# EAGLE design CircuitoPedaleiraTcc2 (EAGLE 7.6.0)
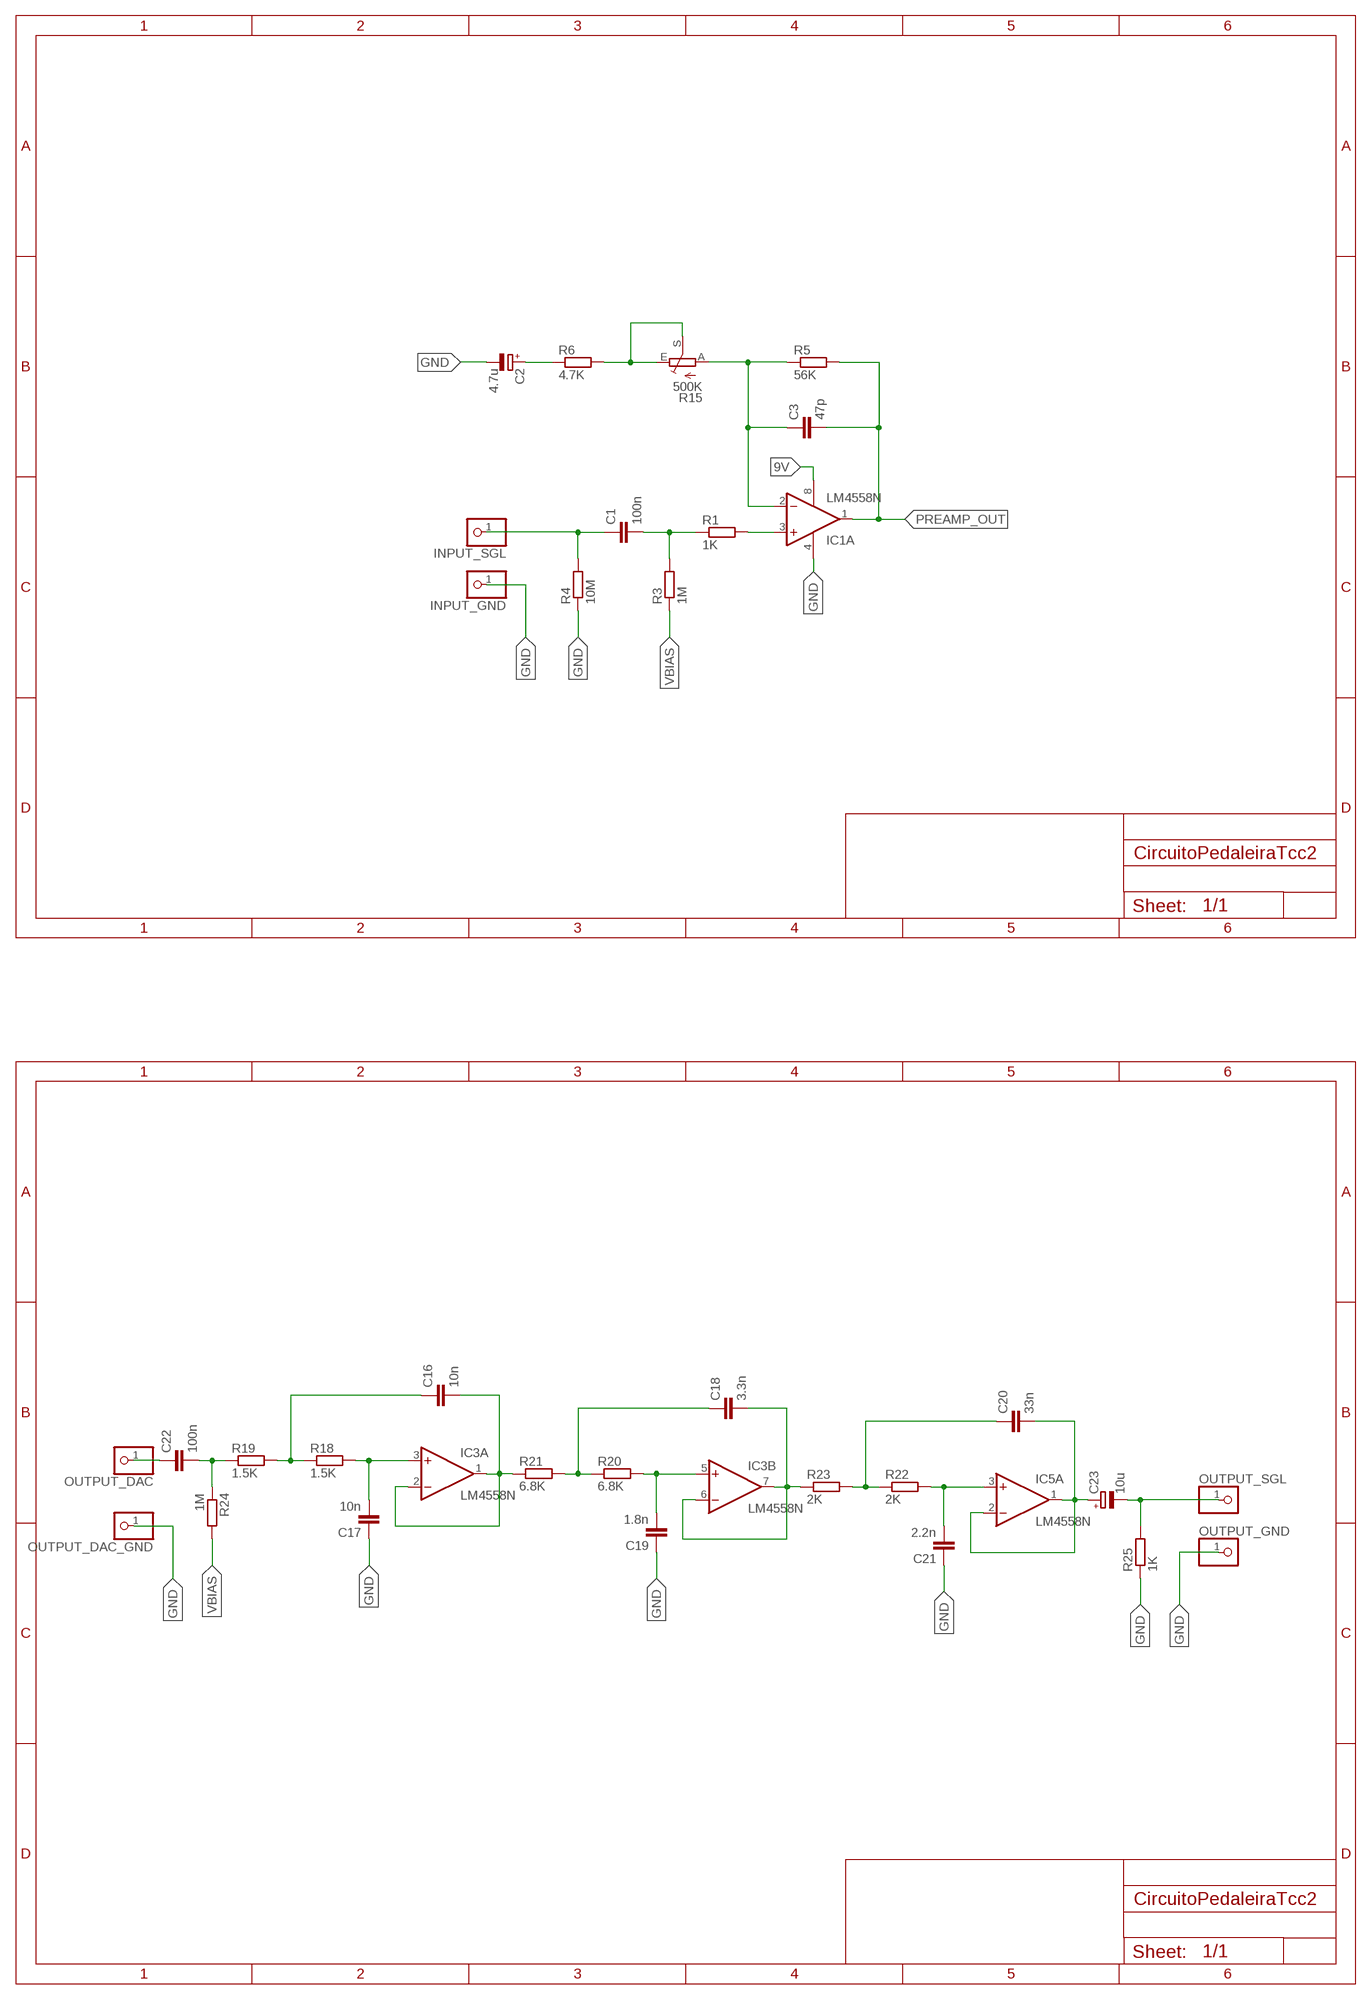
[diagram p0: schematic, sheet 1, part 1 of 3]
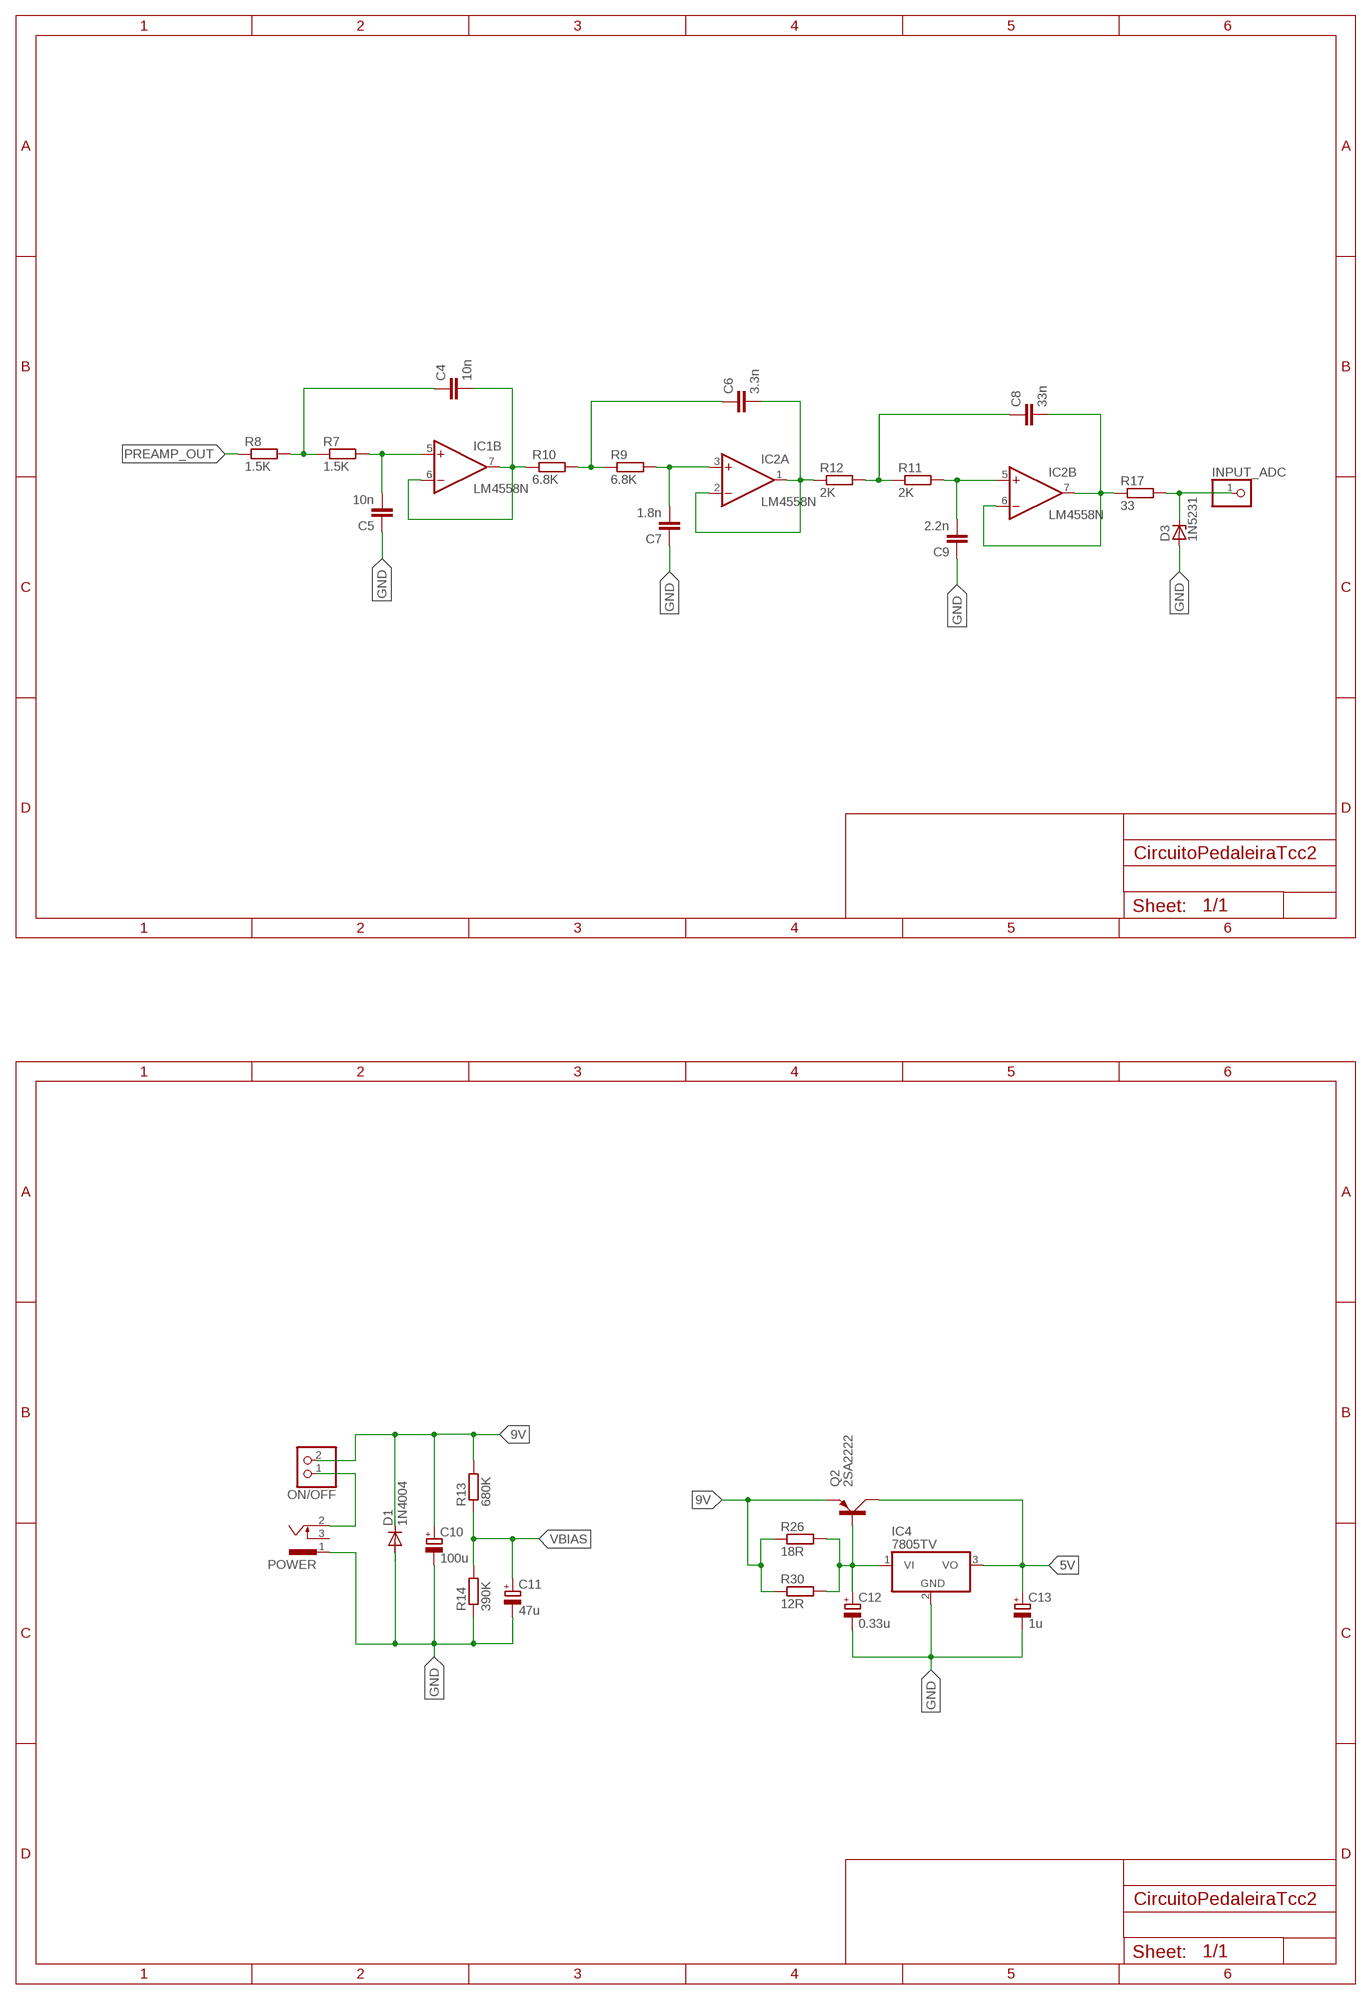
[diagram p1: schematic, sheet 1, part 2 of 3]
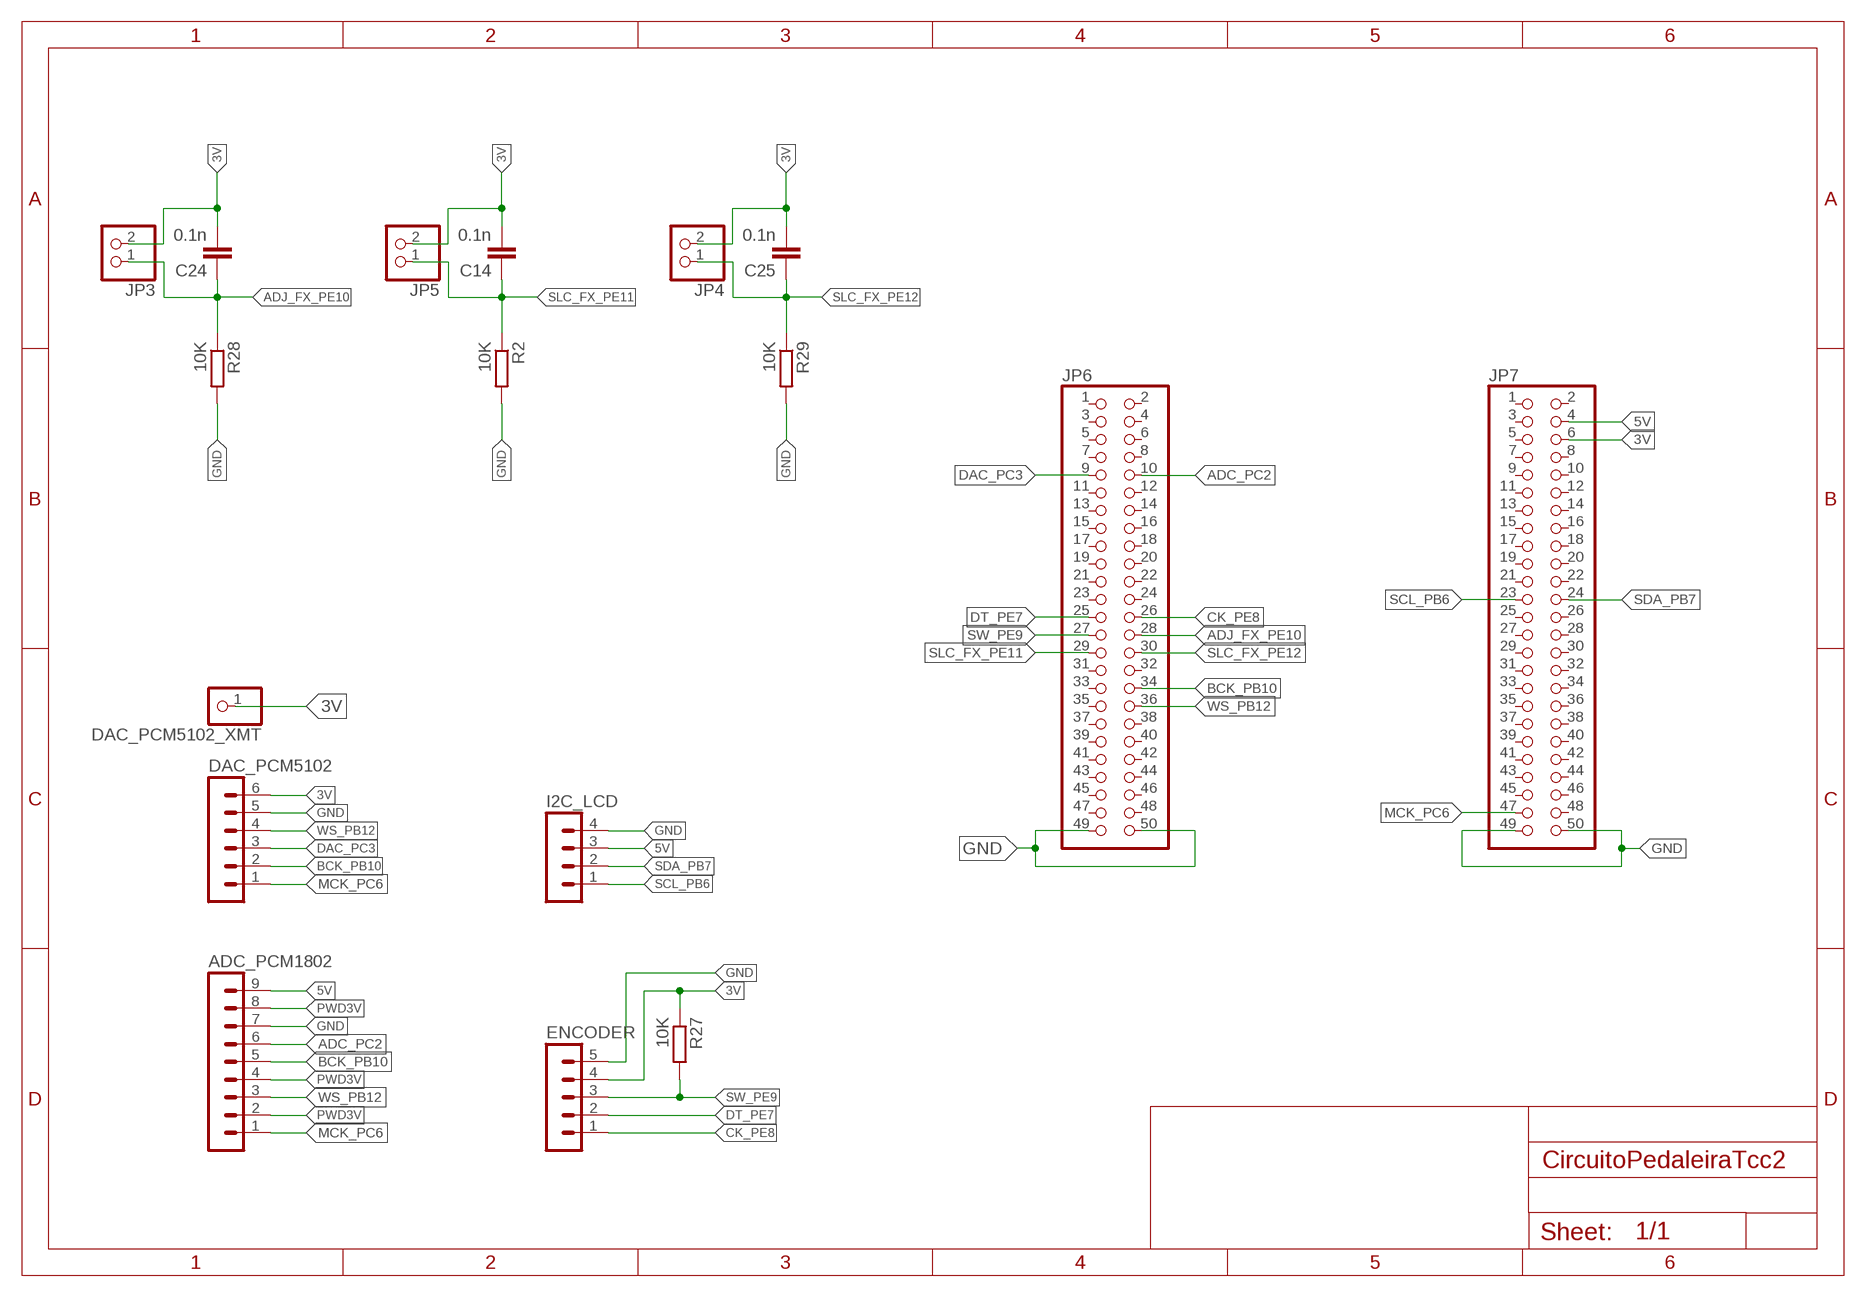
[diagram p2: schematic, sheet 1, part 3 of 3]

## Parts
ADC_PCM1802  MA09-1  [MA09-1]
C1  100n  C-EU025-025X050  [C025-025X050]
C2  4.7u  CPOL-EUE2.5-6  [E2,5-6]
C3  47p  C-EU025-025X050  [C025-025X050]
C4  10n  C-EU025-025X050  [C025-025X050]
C5  10n  C-EU025-025X050  [C025-025X050]
C6  3.3n  C-EU025-025X050  [C025-025X050]
C7  1.8n  C-EU025-025X050  [C025-025X050]
C8  33n  C-EU025-025X050  [C025-025X050]
C9  2.2n  C-EU025-025X050  [C025-025X050]
C10  100u  CPOL-EUE2.5-6  [E2,5-6]
C11  47u  CPOL-EUE2.5-6  [E2,5-6]
C12  0.33u  CPOL-EUE2.5-6  [E2,5-6]
C13  1u  CPOL-EUE2.5-6  [E2,5-6]
C14  0.1n  C-EU025-025X050  [C025-025X050]
C16  10n  C-EU025-025X050  [C025-025X050]
C17  10n  C-EU025-025X050  [C025-025X050]
C18  3.3n  C-EU025-025X050  [C025-025X050]
C19  1.8n  C-EU025-025X050  [C025-025X050]
C20  33n  C-EU025-025X050  [C025-025X050]
C21  2.2n  C-EU025-025X050  [C025-025X050]
C22  100n  C-EU025-025X050  [C025-025X050]
C23  10u  CPOL-EUE2.5-6  [E2,5-6]
C24  0.1n  C-EU025-025X050  [C025-025X050]
C25  0.1n  C-EU025-025X050  [C025-025X050]
D1  1N4004  [DO41-10]
D3  1N5231  ZENER-DIODEDO35Z10  [DO35Z10]
DAC_PCM5102  MA06-1  [MA06-1]
DAC_PCM5102_XMT  PINHD-1X1  [1X01]
ENCODER  MA05-1  [MA05-1]
I2C_LCD  MA04-1  [MA04-1]
IC1  LM4558N  [DIL08]
IC2  LM4558N  [DIL08]
IC3  LM4558N  [DIL08]
IC4  7805TV  [TO220V]
IC5  LM4558N  [DIL08]
INPUT_ADC  PINHD-1X1  [1X01]
INPUT_GND  PINHD-1X1  [1X01]
INPUT_SGL  PINHD-1X1  [1X01]
JP3  PINHD-1X2  [1X02]
JP4  PINHD-1X2  [1X02]
JP5  PINHD-1X2  [1X02]
JP6  PINHD-2X25  [2X25]
JP7  PINHD-2X25  [2X25]
ON/OFF  PINHD-1X2  [1X02]
OUTPUT_DAC  PINHD-1X1  [1X01]
OUTPUT_DAC_GND  PINHD-1X1  [1X01]
OUTPUT_GND  PINHD-1X1  [1X01]
OUTPUT_SGL  PINHD-1X1  [1X01]
POWER  SCD-014A  [SCD-014-A]
Q2  2SA2222  TIP42C  [TO220AV]
R1  1K  R-EU_0204/7  [0204/7]
R2  10K  R-EU_0204/7  [0204/7]
R3  1M  R-EU_0204/7  [0204/7]
R4  10M  R-EU_0204/7  [0204/7]
R5  56K  R-EU_0204/7  [0204/7]
R6  4.7K  R-EU_0204/7  [0204/7]
R7  1.5K  R-EU_0204/7  [0204/7]
R8  1.5K  R-EU_0204/7  [0204/7]
R9  6.8K  R-EU_0204/7  [0204/7]
R10  6.8K  R-EU_0204/7  [0204/7]
R11  2K  R-EU_0204/7  [0204/7]
R12  2K  R-EU_0204/7  [0204/7]
R13  680K  R-EU_0204/7  [0204/7]
R14  390K  R-EU_0204/7  [0204/7]
R15  500K  TRIM_EU-B25X  [B25X]
R17  33  R-EU_0204/7  [0204/7]
R18  1.5K  R-EU_0204/7  [0204/7]
R19  1.5K  R-EU_0204/7  [0204/7]
R20  6.8K  R-EU_0204/7  [0204/7]
R21  6.8K  R-EU_0204/7  [0204/7]
R22  2K  R-EU_0204/7  [0204/7]
R23  2K  R-EU_0204/7  [0204/7]
R24  1M  R-EU_0204/7  [0204/7]
R25  1K  R-EU_0204/7  [0204/7]
R26  18R  R-EU_0411/15  [0411/15]
R27  10K  R-EU_0204/7  [0204/7]
R28  10K  R-EU_0204/7  [0204/7]
R29  10K  R-EU_0204/7  [0204/7]
R30  12R  R-EU_0411/15  [0411/15]

## Nets
3V: C14.2 C24.2 C25.2 DAC_PCM5102.6 DAC_PCM5102_XMT.1 ENCODER.4 JP3.2 JP4.2 JP5.2 JP7.6 R27.1
5V: ADC_PCM1802.9 C13.+ I2C_LCD.3 IC4.3(VO) JP7.4 Q2.C
9V: C10.+ D1.C IC1.8(P:V+) ON/OFF.2 Q2.E R13.2 R26.1 R30.1
ADC_PC2: ADC_PCM1802.6 JP6.10
ADJ_FX_PE10: C24.1 JP3.1 JP6.28 R28.1
AL_LP_OUT: C8.2 IC2.6(B:-IN) IC2.7(B:OUT) R17.1
AL_LP_OUT1: C20.2 C23.+ IC5.1(A:OUT) IC5.2(A:-IN)
BCK_PB10: ADC_PCM1802.5 DAC_PCM5102.2 JP6.34
CK_PE8: ENCODER.1 JP6.26
DAC_PC3: DAC_PCM5102.3 JP6.9
DT_PE7: ENCODER.2 JP6.25
GND: ADC_PCM1802.7 C2.- C5.1 C7.1 C9.1 C10.- C11.- C12.- C13.- C17.1 C19.1 C21.1 D1.A D3.A DAC_PCM5102.5 ENCODER.5 I2C_LCD.4 IC1.4(P:V-) IC4.2(GND) INPUT_GND.1 JP6.49 JP6.50 JP7.49 JP7.50 OUTPUT_DAC_GND.1 OUTPUT_GND.1 POWER.1 R2.2 R4.1 R14.1 R25.1 R28.2 R29.2
INPUT: C1.1 INPUT_SGL.1 R4.2
INPUT_ADC: D3.C INPUT_ADC.1 R17.2
MCK_PC6: ADC_PCM1802.1 DAC_PCM5102.1 JP7.47
N$1: IC1.3(A:+IN) R1.2
N$2: C1.2 R1.1 R3.2
N$3: ON/OFF.1 POWER.2
N$4: C3.1 IC1.2(A:-IN) R5.1 R15.A
N$5: C4.2 IC1.6(B:-IN) IC1.7(B:OUT) R10.1
N$6: R6.2 R15.E R15.S
N$7: C2.+ R6.1
N$8: C16.2 IC3.1(A:OUT) IC3.2(A:-IN) R21.1
N$9: C5.2 IC1.5(B:+IN) R7.2
N$10: C4.1 R7.1 R8.2
N$11: C6.2 IC2.1(A:OUT) IC2.2(A:-IN) R12.1
N$12: C7.2 IC2.3(A:+IN) R9.2
N$13: C6.1 R9.1 R10.2
N$14: C9.2 IC2.5(B:+IN) R11.2
N$15: C8.1 R11.1 R12.2
N$16: C17.2 IC3.3(A:+IN) R18.2
N$17: C16.1 R18.1 R19.2
N$18: C18.2 IC3.6(B:-IN) IC3.7(B:OUT) R23.1
N$19: C19.2 IC3.5(B:+IN) R20.2
N$20: C18.1 R20.1 R21.2
N$21: C21.2 IC5.3(A:+IN) R22.2
N$22: C20.1 R22.1 R23.2
N$23: C22.2 R19.1 R24.1
N$24: C22.1 OUTPUT_DAC.1
N$25: C12.+ IC4.1(VI) Q2.B R26.2 R30.2
OUTPUT: C23.- OUTPUT_SGL.1 R25.2
PREAMP_OUT: C3.2 IC1.1(A:OUT) R5.2 R8.1
PWD3V: ADC_PCM1802.2 ADC_PCM1802.4 ADC_PCM1802.8
SCL_PB6: I2C_LCD.1 JP7.23
SDA_PB7: I2C_LCD.2 JP7.24
SLC_FX_PE11: C14.1 JP5.1 JP6.29 R2.1
SLC_FX_PE12: C25.1 JP4.1 JP6.30 R29.1
SW_PE9: ENCODER.3 JP6.27 R27.2
VBIAS: C11.+ R3.1 R13.1 R14.2 R24.2
WS_PB12: ADC_PCM1802.3 DAC_PCM5102.4 JP6.36
Unconnected: IC5.5(B:+IN) IC5.6(B:-IN) IC5.7(B:OUT) JP6.1 JP6.2 JP6.3 JP6.4 JP6.5 JP6.6 JP6.7 JP6.8 JP6.11 JP6.12 JP6.13 JP6.14 JP6.15 JP6.16 JP6.17 JP6.18 JP6.19 JP6.20 JP6.21 JP6.22 JP6.23 JP6.24 JP6.31 JP6.32 JP6.33 JP6.35 JP6.37 JP6.38 JP6.39 JP6.40 JP6.41 JP6.42 JP6.43 JP6.44 JP6.45 JP6.46 JP6.47 JP6.48 JP7.1 JP7.2 JP7.3 JP7.5 JP7.7 JP7.8 JP7.9 JP7.10 JP7.11 JP7.12 JP7.13 JP7.14 JP7.15 JP7.16 JP7.17 JP7.18 JP7.19 JP7.20 JP7.21 JP7.22 JP7.25 JP7.26 JP7.27 JP7.28 JP7.29 JP7.30 JP7.31 JP7.32 JP7.33 JP7.34 JP7.35 JP7.36 JP7.37 JP7.38 JP7.39 JP7.40 JP7.41 JP7.42 JP7.43 JP7.44 JP7.45 JP7.46 JP7.48 POWER.3

## Power pins joined to a net without a drawn wire
V+: IC2.8(P:V+) IC3.8(P:V+) IC5.8(P:V+)
V-: IC2.4(P:V-) IC3.4(P:V-) IC5.4(P:V-)

## Library data of the parts
ADC_PCM1802 = con-lstb:MA09-1: PIN HEADER; OC_FARNELL: unknown; OC_NEWARK: unknown
C1 C3-C9 C14 C16-C22 C24 C25 = rcl:C-EU: CAPACITOR, European symbol
C2 C10-C13 C23 = rcl:CPOL-EU: POLARIZED CAPACITOR, European symbol
D1 = diode:1N4004: DIODE general purpose rectifier, 1 A
D3 = diode:ZENER-DIODE: Z-Diode
DAC_PCM5102 = con-lstb:MA06-1: PIN HEADER; OC_FARNELL: unknown; OC_NEWARK: unknown
DAC_PCM5102_XMT INPUT_ADC INPUT_GND INPUT_SGL OUTPUT_DAC OUTPUT_DAC_GND OUTPUT_GND OUTPUT_SGL = pinhead:PINHD-1X1: PIN HEADER
ENCODER = con-lstb:MA05-1: PIN HEADER; OC_FARNELL: unknown; OC_NEWARK: unknown
I2C_LCD = con-lstb:MA04-1: PIN HEADER; OC_FARNELL: unknown; OC_NEWARK: unknown
IC1-IC3 IC5 = linear:*4558: OP AMP
IC4 = linear:78*: Positive VOLTAGE REGULATOR Source: http://cache.national.com/ds/LM/LM78L05.pdf http://www.fairchildsemi.com/ds/LM/LM7805.pdf
JP3-JP5 ON/OFF = pinhead:PINHD-1X2: PIN HEADER
JP6 JP7 = pinhead:PINHD-2X25: PIN HEADER
POWER = con-shiua-chyuan:SCD-014A: Power Jack 2.5mm; OC_FARNELL: unknown; OC_NEWARK: unknown
Q2 = transistor-power:TIP42C: PNP TRANSISTOR
R1-R14 R17-R30 = rcl:R-EU_: RESISTOR, European symbol
R15 = pot:TRIM_EU-: POTENTIOMETER

## Board
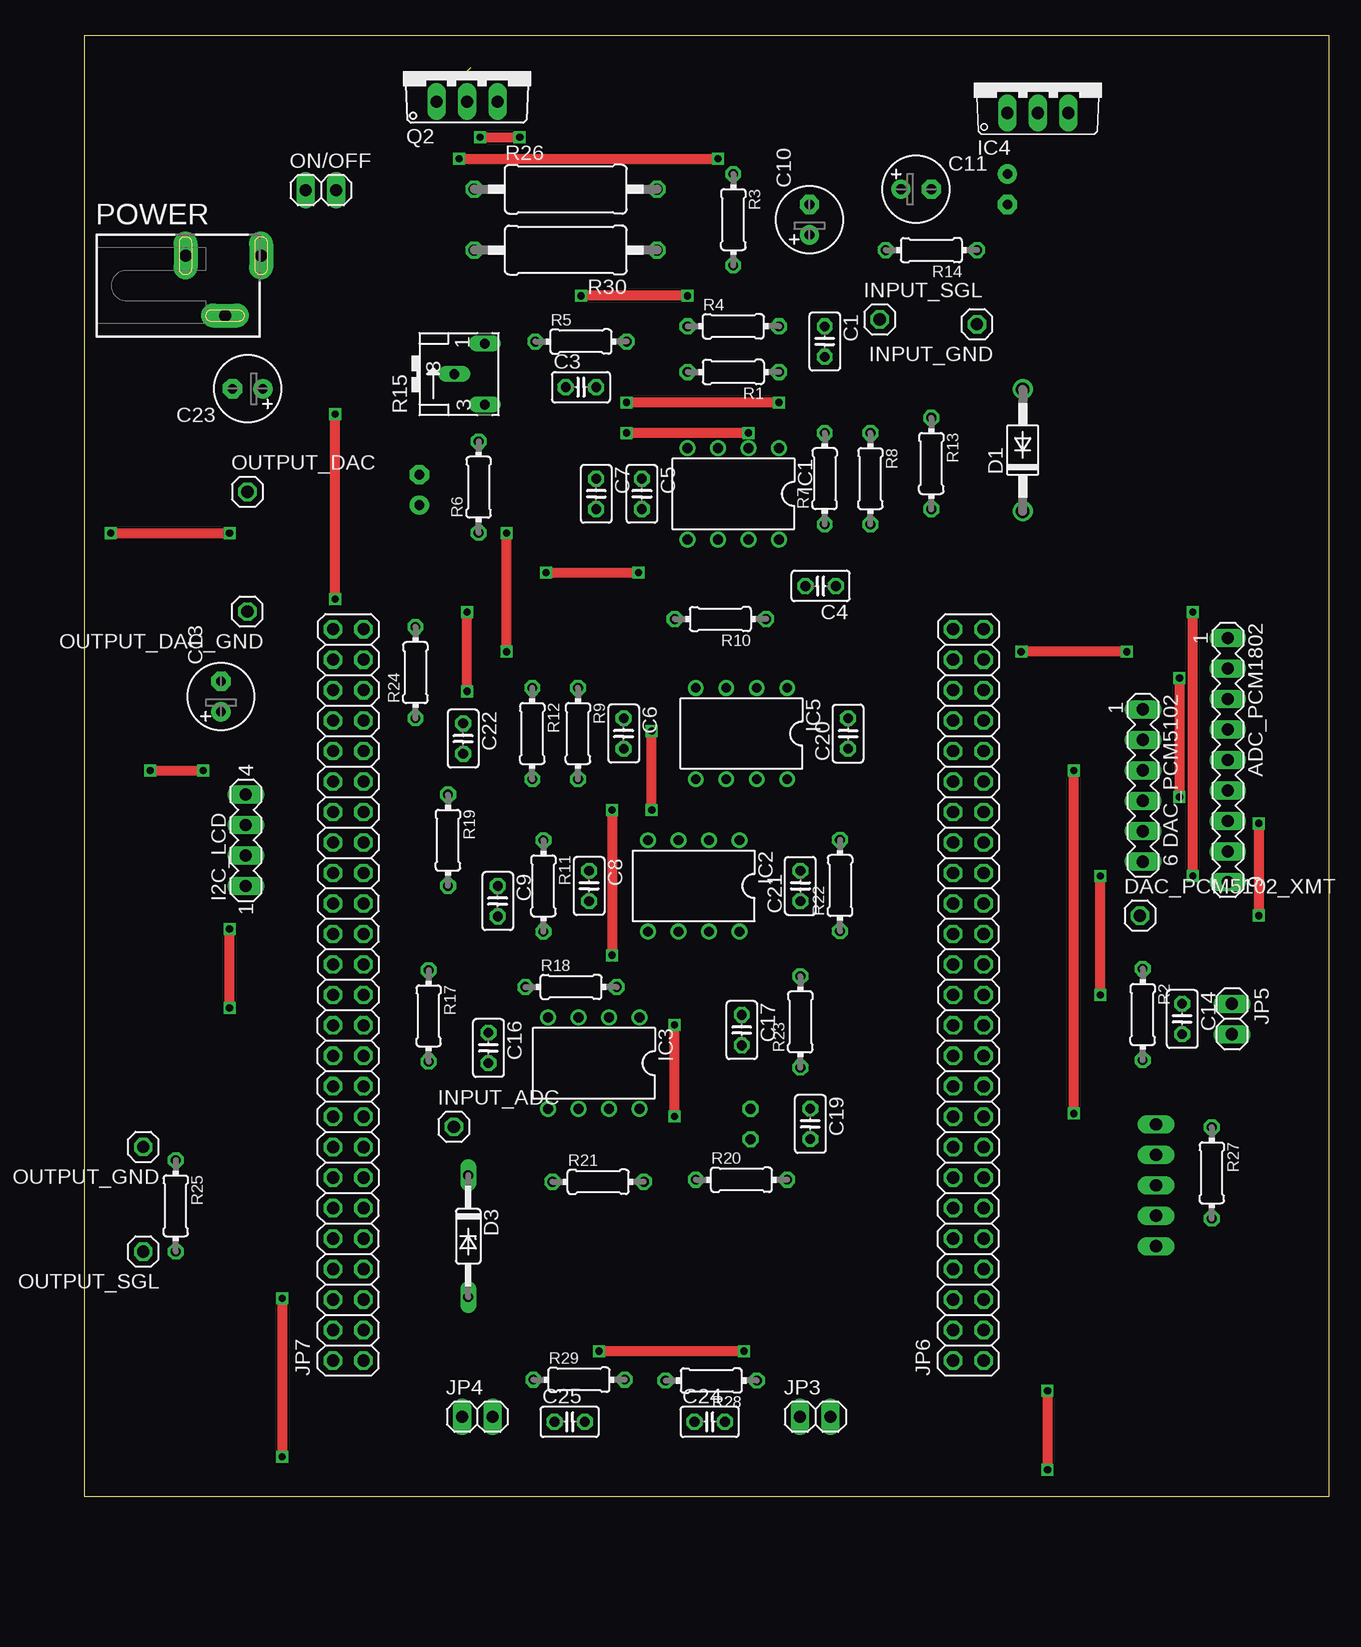
[diagram p3: board, top side]
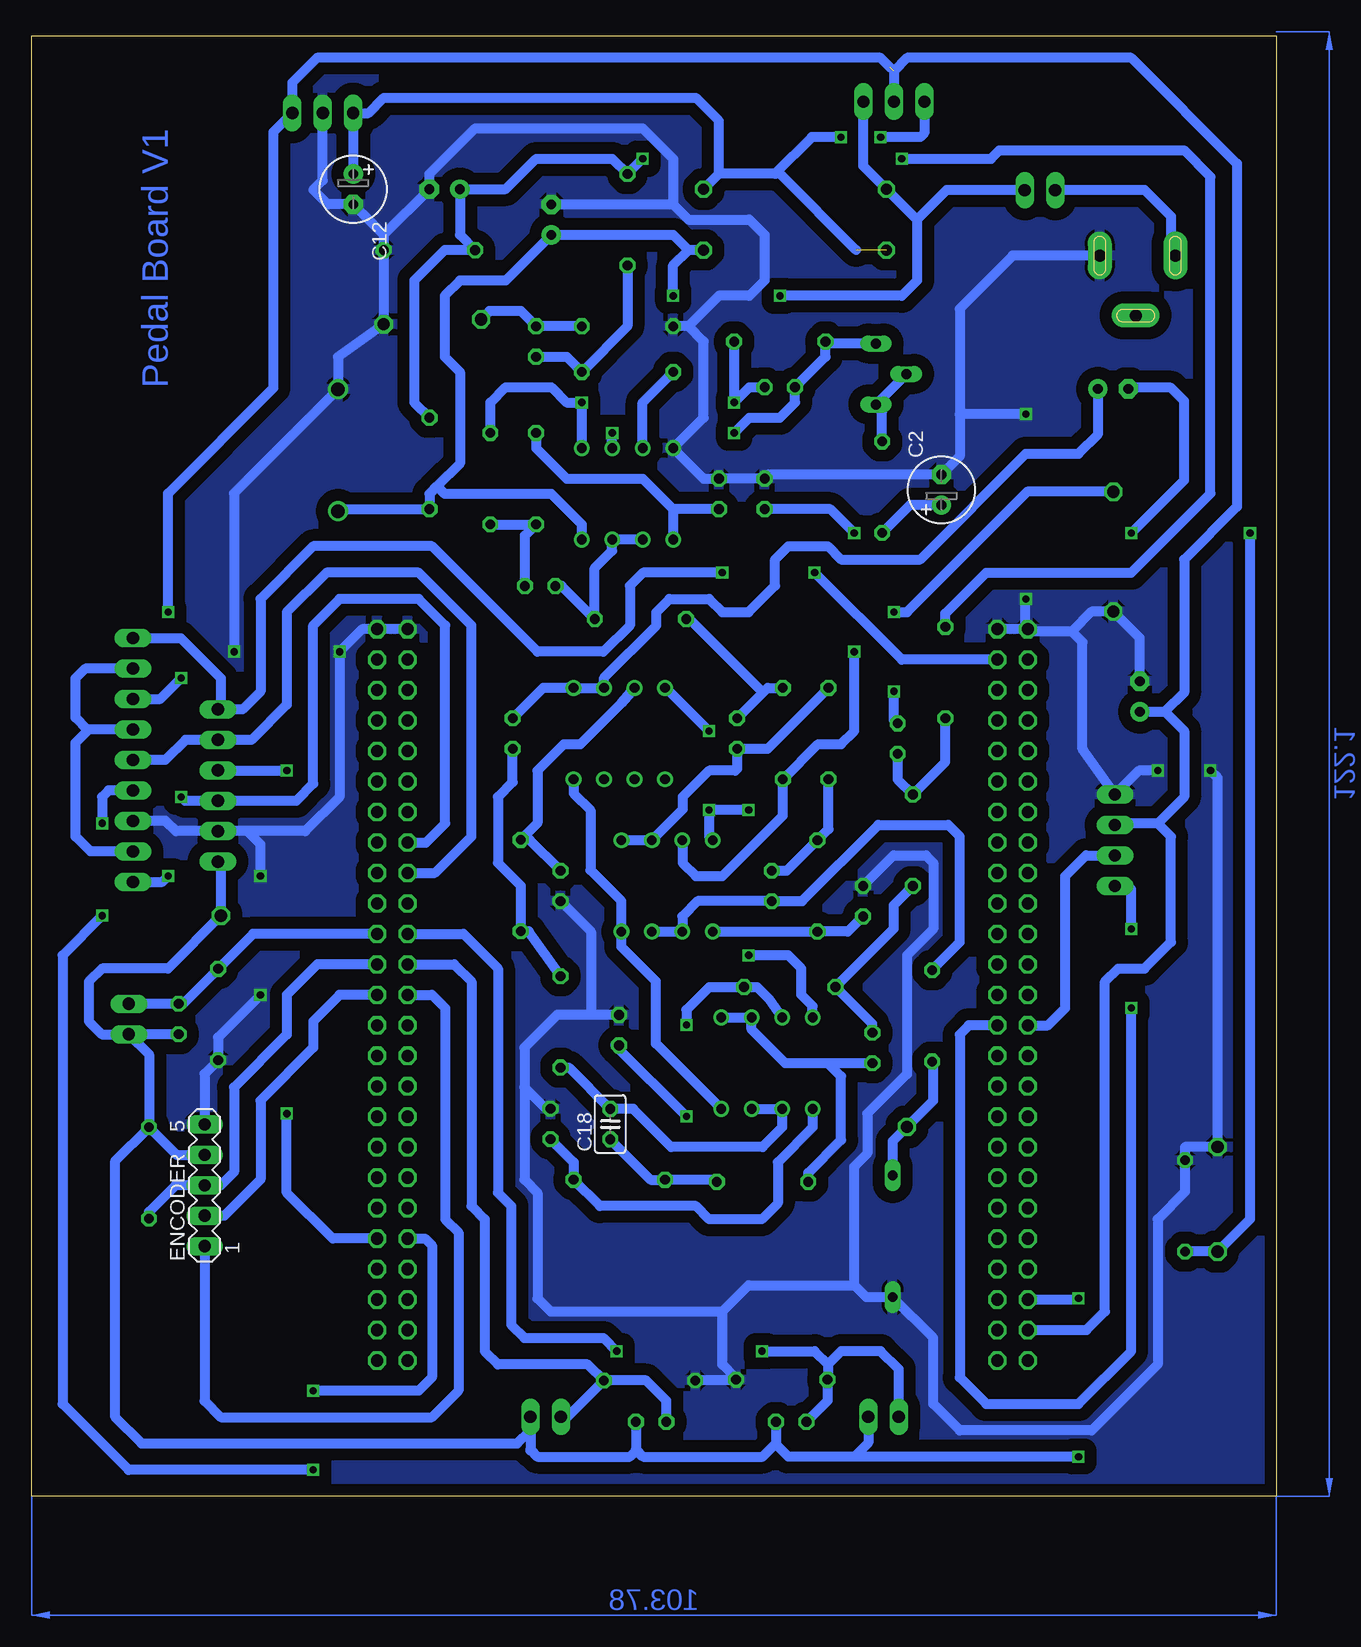
[diagram p4: board, bottom side, seen from below]

Size 103.78 x 121.76 mm. Coordinates in mm from the lower left corner, seen from the top.
Outline: 0,0 103.78,0 103.78,121.76 0,121.76 0,0
Copper layers (1*16): Top 0.035mm / dielectric 1.5mm / Bottom 0.035mm
Design rules "default *": minimum track width 1mm, minimum drill 24mil, track to track 1mm, track to pad 1mm, pad to pad 8mil, via to via 8mil, smd to smd 8mil, copper to edge 1mm, drill to drill 8mil, minimum pad ring 10mil, minimum via ring 8mil, stop-mask expansion 4mil, vias tented up to drill 0mil, thermal gap 10mil

### Footprints (pad centres in the part's own frame; a part is rotated, then mirrored left to right if it is on the bottom)
MA09-1 = drill 1.016 long: 1 -10.16,0; 2 -7.62,0; 3 -5.08,0; 4 -2.54,0; 5 0,0; 6 2.54,0; 7 5.08,0; 8 7.62,0; 9 10.16,0
C025-025X050 = drill 0.813 octagon: 1 -1.27,0; 2 1.27,0
E2,5-6 = drill 0.813 pad 1.6: + -1.27,0 | drill 0.813 pad 1.6 octagon: - 1.27,0
DO41-10 = drill 1.118: A 5.08,0; C -5.08,0
DO35Z10 = drill 0.813 long: A 5.08,0; C -5.08,0
MA06-1 = drill 1.016 long: 1 -6.35,0; 2 -3.81,0; 3 -1.27,0; 4 1.27,0; 5 3.81,0; 6 6.35,0
1X01 = drill 1.016 octagon: 1 0,0
MA05-1 = drill 1.016 long: 1 -5.08,0; 2 -2.54,0; 3 0,0; 4 2.54,0; 5 5.08,0
MA04-1 = drill 1.016 long: 1 -3.81,0; 2 -1.27,0; 3 1.27,0; 4 3.81,0
DIL08 = drill 0.813 pad 1.27: 1 -3.81,-3.81; 2 -1.27,-3.81; 3 1.27,-3.81; 4 3.81,-3.81; 5 3.81,3.81; 6 1.27,3.81; 7 -1.27,3.81; 8 -3.81,3.81
TO220V = drill 1.016 long: 1 -2.54,-2.54; 2 0,-2.54; 3 2.54,-2.54
1X02 = drill 1.016 long: 1 -1.27,0; 2 1.27,0
2X25 = drill 1.016 octagon: 1 -30.48,-1.27; 2 -30.48,1.27; 3 -27.94,-1.27; 4 -27.94,1.27; 5 -25.4,-1.27; 6 -25.4,1.27; 7 -22.86,-1.27; 8 -22.86,1.27; 9 -20.32,-1.27; 10 -20.32,1.27; 11 -17.78,-1.27; 12 -17.78,1.27; 13 -15.24,-1.27; 14 -15.24,1.27; 15 -12.7,-1.27; 16 -12.7,1.27; 17 -10.16,-1.27; 18 -10.16,1.27; 19 -7.62,-1.27; 20 -7.62,1.27; 21 -5.08,-1.27; 22 -5.08,1.27; 23 -2.54,-1.27; 24 -2.54,1.27; 25 0,-1.27; 26 0,1.27; 27 2.54,-1.27; 28 2.54,1.27; 29 5.08,-1.27; 30 5.08,1.27; 31 7.62,-1.27; 32 7.62,1.27; 33 10.16,-1.27; 34 10.16,1.27; 35 12.7,-1.27; 36 12.7,1.27; 37 15.24,-1.27; 38 15.24,1.27; 39 17.78,-1.27; 40 17.78,1.27; 41 20.32,-1.27; 42 20.32,1.27; 43 22.86,-1.27; 44 22.86,1.27; 45 25.4,-1.27; 46 25.4,1.27; 47 27.94,-1.27; 48 27.94,1.27; 49 30.48,-1.27; 50 30.48,1.27
SCD-014-A = drill 1 pad 2 long: 1 -2.5,13.8; 2 -2.5,7.5; 3 2.5,10.8
TO220AV = drill 1.016 long: B -2.54,-2.54; C 0,-2.54; E 2.54,-2.54
0204/7 = drill 0.813 octagon: 1 -3.81,0; 2 3.81,0
B25X = drill 0.813 long: A 2.54,-1.905; E -2.54,-1.905; S 0,0.635
0411/15 = drill 0.914 octagon: 1 -7.62,0; 2 7.62,0

### Placement (x,y rotation side)
ADC_PCM1802  95.33,61.38 270 top
C1  61.72,96.26 270 top
C2  27.93,83.9 90 bottom
C3  41.4,92.45 0 top
C4  61.38,75.88 180 top
C5  46.48,83.56 270 top
C6  44.96,63.58 270 top
C7  42.67,83.56 270 top
C8  42.08,50.88 270 top
C9  34.46,49.61 270 top
C10  60.45,106.42 90 top
C11  69.34,108.96 0 top
C12  76.96,108.96 270 bottom
C13  11.39,66.67 90 top
C14  91.52,39.79 270 top
C16  33.69,37.38 270 top
C17  54.8,38.86 270 top
C18  55.54,31.02 90 bottom
C19  60.52,31.04 270 top
C20  63.67,63.58 90 top
C21  59.69,50.88 90 top
C22  31.58,63.16 270 top
C23  13.62,92.32 180 top
C24  52.13,6.21 0 top
C25  40.46,6.21 0 top
D1  78.23,87.2 90 top
D3  32,21.68 270 top
DAC_PCM5102  88.25,59.25 270 top
DAC_PCM5102_XMT  88,48.4 0 top
ENCODER  89.35,25.93 90 bottom
I2C_LCD  13.46,54.69 90 top
IC1  54.1,83.56 180 top
IC2  50.8,50.88 180 top
IC3  42.48,36.1 180 top
IC4  79.5,117.85 0 top
IC5  54.78,63.58 180 top
INPUT_ADC  30.8,30.8 0 top
INPUT_GND  74.42,97.7 180 top
INPUT_SGL  66.3,98.1 0 top
JP3  60.93,6.63 0 top
JP4  32.76,6.63 0 top
JP5  95.67,39.79 270 top
JP6  73.7,41.8 90 top
JP7  22,41.8 90 top
ON/OFF  19.72,108.88 0 top
OUTPUT_DAC  13.59,83.73 0 top
OUTPUT_DAC_GND  13.59,73.75 180 top
OUTPUT_GND  4.91,29.12 180 top
OUTPUT_SGL  4.91,20.4 180 top
POWER  0.93,100.92 270 top
Q2  31.9,118.8 0 top
R1  54.1,93.72 180 top
R2  88.23,40.16 270 top
R3  54.1,106.42 270 top
R4  54.1,97.53 0 top
R5  41.4,96.26 0 top
R6  32.87,84.12 90 top
R7  61.72,84.83 90 top
R8  65.53,84.83 270 top
R9  41.15,63.58 270 top
R10  53.02,73.13 180 top
R11  38.27,50.88 270 top
R12  37.34,63.58 270 top
R13  70.61,86.1 270 top
R14  70.61,103.88 180 top
R15  31.49,93.55 90 top
R17  28.7,40.05 270 top
R18  40.57,42.45 0 top
R19  30.31,54.69 270 top
R20  54.78,26.39 0 top
R21  42.84,26.21 0 top
R22  63,50.91 90 top
R23  59.69,39.55 90 top
R24  27.6,68.66 90 top
R25  7.62,24.21 270 top
R26  40.13,108.96 0 top
R27  93.99,26.96 270 top
R28  52.26,9.65 180 top
R29  41.24,9.72 0 top
R30  40.13,103.88 180 top

### Tracks (layer width: path | path; a pad name or v marks a point on that pad's centre or on a via)
3V  (via drill 0.6)
  Top 0.813: v16.5,16.5 v16.5,3.3
  Bottom 0.813: R27.1 91.69,28.47 ENCODER.4 | R27.1 96.8,27.96 96.8,6.6 94.6,4.4 63.3,4.4 62.2,5.5 | C25.2 41.73,4.4 | 41.73,4.4 41.73,4.33 40.7,3.3 35.2,3.3 | C24.2 53.4,3.9 | 53.4,3.9 52.8,3.3 42.83,3.3 41.73,4.4 | DAC_PCM5102.6 88,52.9 DAC_PCM5102_XMT.1 92.4,44 97.9,44 99,42.9 99,39.6 97.92,38.52 JP5.2 | C14.2 JP5.2 | JP5.2 93.99,36.84 R27.1 | v16.5,3.3 35.2,3.3 | JP4.2 34.03,4.47 35.2,3.3 | JP7.6 16.6,16.4 v16.5,16.5 | 53.4,3.9 53.4,3.8 53.9,3.3 61.6,3.3 62.2,3.9 | JP3.2 62.2,5.5 | 62.2,5.5 62.2,3.9 | 62.2,3.9 62.2,3.8
5V  (via drill 0.6)  (1 unrouted)
  Top 0.813: v92.4,51.7 v92.4,73.7
  Bottom 0.813: ADC_PCM1802.9 92.88,51.22 v92.4,51.7 | 9.9,56.1 8.8,55 8.8,46.2 11,44 13.2,44 14.3,42.9 14.3,15.4 15.84,13.86 JP7.4 | 9.9,56.1 12.22,56.1 I2C_LCD.3 | C13.+ 9.3,65.4 | 9.3,65.4 7.7,63.8 7.7,58.3 9.9,56.1 | v92.4,73.7 92.4,83.6 83.6,92.4 83.6,113.75 IC4.3 82.04,117.85 79.99,119.9 33,119.9 32.22,119.12 | 9.3,65.4 7.7,67 7.7,78.1 3.3,82.5 3.3,111.1 12.1,119.9 30.8,119.9 31.9,118.8 Q2.C
9V  (via drill 0.6)
  Top 0.813: v50.29,100.07 v41.4,100.07
  Bottom 0.813: 49.02,103.88 50.29,105.15 C10.+ 64.26,101.34 68.07,101.34 69.34,100.07 69.34,94.99 68.07,93.72 68.07,86.1 69.97,84.19 | 29.97,106.42 29.97,101.34 31.24,100.07 v41.4,100.07 | 69.97,84.19 70.61,83.56 R13.2 78.06,82.29 D1.C | IC1.8 57.91,81.02 60.45,83.56 69.34,83.56 69.97,84.19 | ON/OFF.2 27.51,108.88 29.97,106.42 | Q2.E 34.44,110.89 R26.1 29.97,106.42 | v50.29,100.07 50.29,102.61 49.02,103.88 | R30.1 49.02,103.88
ADC_PC2  (via drill 0.6)
  Top 0.813: v80.3,8.8 v80.3,2.2 | v97.9,56.1 v97.9,48.4
  Bottom 0.813: v80.3,2.2 95.7,2.2 101.2,7.7 101.2,45.1 v97.9,48.4 | ADC_PCM1802.6 97.36,58.84 97.9,58.3 v97.9,56.1 | v80.3,8.8 71.5,8.8 70.4,9.9 70.4,20.9 70.98,21.48 JP6.10
ADJ_FX_PE10
  Bottom 0.813: C24.1 50.86,7.96 52.55,9.65 R28.1 | JP6.28 68.54,44.34 67.1,42.9 67.1,24.2 66,23.1 66,12.1 64.9,11 57.42,11 R28.1 | R28.1 59.09,6.63 JP3.1
AL_LP_OUT
  Bottom 0.813: IC2.7 IC2.6 49.53,48.34 48.26,49.61 C8.2 39.54,49.61 33.19,55.96 27.36,55.96 26.4,55 26.4,46.2 28.7,43.9 R17.1
AL_LP_OUT1
  Bottom 0.813: C20.2 61.13,67.39 IC5.1 IC5.2 56.05,68.25 51.7,72.6 51.7,73.7 50.6,74.8 47.3,74.8 46.2,73.7 44,73.7 41.8,75.9 41.8,78.1 40.7,79.2 37.4,79.2 36.3,78.1 29.7,78.1 20.9,86.9 16.5,86.9 14.89,88.51 C23.+
BCK_PB10
  Bottom 0.813: ADC_PCM1802.5 92.62,61.38 90.94,63.06 DAC_PCM5102.2 85.44,63.06 82.5,66 82.5,73.7 79.2,77 71.5,77 67.1,72.6 67.1,55 70.14,51.96 JP6.34
CK_PE8
  Bottom 0.813: ENCODER.1 89.35,7.95 88,6.6 70.4,6.6 68.2,8.8 68.2,22 69.3,23.1 69.3,40.7 70.4,41.8 JP6.26
DAC_PC3  (via drill 0.6)
  Top 0.813: v82.5,31.9 v82.5,60.5
  Bottom 0.813: DAC_PCM5102.3 88.23,60.5 v82.5,60.5 | JP6.9 78.68,21.48 82.5,25.3 v82.5,31.9
DT_PE7
  Bottom 0.813: ENCODER.2 87.71,23.39 84.7,26.4 84.7,33 80.3,37.4 80.3,39.6 78.1,41.8 JP6.25
GND  (via drill 0.6)
  Top 0.813: v84.7,41.8 v84.7,51.7 | v86.9,70.4 v78.1,70.4 | v20.9,74.8 v20.9,90.2 | v5.5,60.5 v9.9,60.5
  Bottom 0.813: 49.02,97.53 47.75,96.26 47.75,89.91 IC1.4 47.75,84.83 C5.1 C7.1 42.33,85.17 C2.- 26.4,86.7 26.4,90.2 | 49.02,97.53 R4.1 | 74.42,105.15 C12.- 79.09,107.69 80.3,108.9 79.5,109.7 IC4.2 | 74.42,105.15 R14.1 INPUT_GND.1 78.23,94.99 D1.A 86.9,83.61 v86.9,70.4 | 49.02,97.53 46.48,100.07 43.94,100.07 42.67,101.34 42.67,105.15 43.94,106.42 49.02,106.42 50.29,107.69 | C10.- 50.29,107.69 | 50.29,107.69 50.29,111.5 52.83,114.04 66.8,114.04 70.61,110.23 C11.- 74.42,105.15 | 17.07,72.1 16.17,71.2 16.17,62.31 I2C_LCD.4 11.46,60.5 v9.9,60.5 | C21.1 57.15,47.07 57.15,40.18 57.2,40.13 | C9.1 31.92,53.42 29.22,53.42 28.6,52.8 28.6,47.3 30.8,45.1 30.8,35.2 34.1,31.9 34.1,28.6 35.2,27.5 35.2,17.6 | 85.8,55.44 80.96,55.44 78.1,58.3 v78.1,70.4 76.22,72.28 JP6.49 JP6.50 | 85.8,55.44 DAC_PCM5102.5 91.74,55.44 92.6,56.3 ADC_PCM1802.7 | v84.7,51.7 84.7,54.34 85.8,55.44 | R28.2 45.12,9.65 R29.2 45.05,9.85 46.2,11 46.2,15.4 | POWER.1 21.98,103.42 26.4,99 26.4,90.2 | v20.9,90.2 26.4,90.2 | v20.9,74.8 20.98,74.72 20.98,72.53 JP7.50 | C13.- 11.39,71.55 OUTPUT_DAC_GND.1 15.42,73.75 17.07,72.1 | v84.7,41.8 88.23,38.27 R2.2 89.35,35.23 ENCODER.5 | JP7.50 JP7.49 | 17.07,72.1 20.55,72.1 JP7.50 | v5.5,60.5 4.91,59.91 OUTPUT_GND.1 7.62,29.12 R25.1 7.62,25.38 9.9,23.1 9.9,11 15.4,5.5 26.4,5.5 28.6,7.7 28.6,13.2 D3.A 34.2,16.6 35.2,17.6 | C17.1 57.2,40.13 | 57.2,40.13 59.97,40.13 62.7,37.4 62.7,34.1 | 46.2,15.4 44,17.6 35.2,17.6 | 62.7,34.1 62.7,26.4 61.6,25.3 61.6,16.5 60.5,15.4 46.2,15.4 | C19.1 60.91,32.31 62.7,34.1
  pour Bottom: 0,0 0,122.1 103.4,122.1 103.4,0
INPUT
  Bottom 0.813: R4.2 C1.1 62.99,98.8 65.6,98.8 INPUT_SGL.1
INPUT_ADC
  Bottom 0.813: R17.2 28.6,36.14 28.6,33 INPUT_ADC.1 32,29.6 D3.C
MCK_PC6  (via drill 0.6)
  Top 0.813: v38.5,77 v46.2,77
  Bottom 0.813: ADC_PCM1802.1 91.34,71.54 88,68.2 88,65.85 DAC_PCM5102.1 86.2,65.6 84.7,67.1 84.7,74.8 80.3,79.2 70.4,79.2 61.6,70.4 56.1,70.4 53.9,72.6 53.9,75.9 52.8,77 v46.2,77 | v38.5,77 31.24,69.74 JP7.47
N$1
  Bottom 0.813: IC1.3 52.83,91.18 R1.2
N$2
  Bottom 0.813: R3.2 54.1,97.53 R1.1 59.18,94.99 C1.2
N$3
  Bottom 0.813: ON/OFF.1 18.43,108.9 11,108.9 8.8,106.7 8.8,103.79 POWER.2
N$4  (via drill 0.6)
  Top 0.813: v55.37,88.64 v45.21,88.64
  Bottom 0.813: IC1.2 v55.37,88.64 | v45.21,88.64 43.94,89.91 41.4,89.91 40.13,91.18 C3.1 37.59,94.99 R5.1 37.42,96.09 R15.A
N$5
  Bottom 0.813: IC1.6 IC1.7 55.37,78.83 56.83,77.37 R10.1 59.58,75.88 C4.2
N$6
  Bottom 0.813: R6.2 32.87,90.44 R15.E R15.S
N$7
  Bottom 0.813: C2.+ 30.55,82.63 R6.1
N$8
  Bottom 0.813: IC3.1 IC3.2 43.74,38.91 40.94,36.1 37.4,36.1 | 33.78,36.01 C16.2 37.4,36.1 | R21.1 39.03,26.97 36.3,29.7 36.3,35.01 37.4,36.1
N$9
  Bottom 0.813: 50.29,82.29 52.83,84.83 59.18,84.83 61.72,87.37 R7.2 | C5.2 50.29,82.29 | 50.29,82.29 IC1.5
N$10
  Bottom 0.813: R8.2 R7.1 62.65,80.09 C4.1
N$11
  Bottom 0.813: IC2.1 IC2.2 49.5,57.26 49.5,58.3 47.3,60.5 45.1,60.5 44.96,60.64 C6.2 42.42,62.31 R12.1
N$12  (via drill 0.6)
  Top 0.813: v35.2,70.4 v35.2,80.3
  Bottom 0.813: IC2.3 49.5,54.66 49.5,52.8 48.4,51.7 46.2,51.7 41.15,56.75 R9.2 38.22,62.7 36.3,62.7 35.2,63.8 v35.2,70.4 | v35.2,80.3 37.19,82.29 C7.2
N$13
  Bottom 0.813: 41.15,67.55 R9.1 42.42,67.39 42.8,67 | C6.1 42.8,67 | R10.2 48.93,73.13 42.8,67
N$14
  Bottom 0.813: C9.2 35.73,47.07 R11.2 IC2.5
N$15
  Bottom 0.813: C8.1 40.81,52.15 R11.1 37.34,55.62 R12.2
N$16  (via drill 0.6)
  Top 0.813: v49.19,31.66 v49.19,39.28
  Bottom 0.813: IC3.3 42.3,41.45 43.3,42.45 R18.2 47.28,42.45 49.19,40.55 v49.19,39.28 | C17.2 55.12,37.59 v49.19,31.66
N$17
  Bottom 0.813: C16.1 33.69,39.38 R18.1 31.91,47.3 31.9,47.3 31.9,49.29 R19.2
N$18
  Bottom 0.813: R23.1 58.98,35.74 C18.2 53.63,32.3 50.46,29.12 42.84,29.12 41.2,30.75 IC3.6 IC3.7
N$19
  Bottom 0.813: IC3.5 38.66,30.75 41.57,27.85 41.57,24.43 42.9,23.1 47.3,23.1 48.4,24.2 56.4,24.2 R20.2 58.59,27.84 C19.2
N$20
  Bottom 0.813: R21.2 46.83,26.39 R20.1 52.17,26.39 C18.1
N$21
  Bottom 0.813: IC5.3 54.61,66.12 58.03,62.7 59.4,62.7 61.6,60.5 61.6,56.12 R22.2 62.26,54.72 C21.2
N$22
  Bottom 0.813: 63.8,62.18 C20.1 63.67,59.53 64.9,58.3 64.9,52.8 63,50.9 R22.1 62.33,47.1 R23.2
N$23
  Bottom 0.813: R24.1 27.6,61.21 R19.1 31.58,59.77 C22.2
N$24  (via drill 0.6)
  Top 0.813: v31.9,67.1 v31.9,73.7
  Bottom 0.813: C22.1 31.9,64.75 v31.9,67.1 | v31.9,73.7 30.8,73.7 20.77,83.73 OUTPUT_DAC.1
N$25  (via drill 0.6)  (1 unrouted)
  Top 0.813: v33,113.3 v36.3,113.3
  Bottom 0.813: C12.+ IC4.1 75.69,115.31 74.42,116.58 48.4,116.58 46.48,114.66 46.48,110.23 | 35.05,103.88 41.4,110.23 41.8,110.23 | Q2.B 29.36,113.64 29.7,113.3 v33,113.3 | 41.8,110.23 46.48,110.23 | v36.3,113.3 38.73,113.3 41.8,110.23 | R26.2 46.48,110.23
OUTPUT  (via drill 0.6)
  Top 0.813: v2.2,80.3 v12.1,80.3
  Bottom 0.813: v2.2,80.3 2.2,23.11 OUTPUT_SGL.1 R25.2 | v12.1,80.3 7.7,84.7 7.7,91.3 8.8,92.4 12.27,92.4 C23.-
PREAMP_OUT  (via drill 0.6)
  Top 0.813: v57.91,91.18 v45.21,91.18
  Bottom 0.813: IC1.1 v57.91,91.18 59.18,91.18 60.45,92.45 64.26,92.45 65.53,91.18 R8.1 | C3.2 43.94,92.45 v45.21,91.18 R5.2
PWD3V
  Bottom 0.813: ADC_PCM1802.2 99.3,69 100.1,68.2 100.1,64.9 99.12,63.92 99,63.92 | ADC_PCM1802.4 99,63.92 | ADC_PCM1802.8 98.86,53.76 100.1,55 100.1,62.82 99,63.92
SCL_PB6  (via drill 0.6)
  Top 0.813: v12.1,40.7 v12.1,47.3
  Bottom 0.813: v12.1,47.3 12.1,50.62 I2C_LCD.1 | v12.1,40.7 12.1,12.1 16.5,7.7 24.2,7.7 26.4,9.9 26.4,38.5 25.64,39.26 JP7.23
SDA_PB7
  Bottom 0.813: JP7.24 19.04,39.26 17.6,40.7 17.6,51.7 15.88,53.42 I2C_LCD.2
SLC_FX_PE11
  Bottom 0.813: JP5.1 C14.1 91.14,41.06 R2.1 85.32,46.88 JP6.29
SLC_FX_PE12  (via drill 0.6)
  Top 0.813: v55,12.1 v42.9,12.1
  Bottom 0.813: 37.4,11 36.3,12.1 33,12.1 31.49,10.59 JP4.1 | 37.4,11 37.4,9.75 R29.1 37.43,7.97 C25.1 | v42.9,12.1 38.5,12.1 37.4,11 | JP6.30 67.78,46.88 64.9,44 64.9,25.3 63.8,24.2 63.8,14.3 62.7,13.2 56.1,13.2 v55,12.1
SW_PE9
  Bottom 0.813: R27.2 93.99,23.71 91.77,25.93 ENCODER.3 88,25.93 86.9,27.03 86.9,34.1 82.5,38.5 82.5,41.8 79.96,44.34 JP6.27
V+
  Bottom 0.813: IC3.8 51.73,37.74 51.73,42.92 54.61,45.8 IC2.8 54.61,49.61 57.2,52.2 57.2,57.2 58.59,58.59 IC5.8
V-  (via drill 0.6)
  Top 0.813: v47.3,57.2 v47.3,63.8 | v44,57.2 v44,45.1
  Bottom 0.813: v47.3,63.8 50.89,67.39 IC5.4 | IC3.4 38.66,40.87 39.6,41.8 39.6,44 40.7,45.1 v44,45.1 | IC2.4 47.3,55 v47.3,57.2 v44,57.2
VBIAS  (via drill 0.6)
  Top 0.813: v31.24,111.5 v52.83,111.5
  Bottom 0.813: R13.1 71.88,91.18 71.88,101.34 69.34,103.88 R14.2 68.07,105.15 C11.+ 64.26,108.96 61.72,111.5 55.37,111.5 R3.1 v52.83,111.5 | R24.2 27.6,73.6 24.2,77 12.1,77 5.5,83.6 5.5,110 7.7,112.2 23.1,112.2 23.8,111.5 v31.24,111.5
WS_PB12  (via drill 0.6)
  Top 0.813: v91.3,68.2 v91.3,58.3
  Bottom 0.813: JP6.36 70.9,54.5 69.3,56.1 69.3,72.6 71.5,74.8 78.1,74.8 80.3,72.6 80.3,59.4 81.72,57.98 DAC_PCM5102.4 90.98,57.98 v91.3,58.3 | ADC_PCM1802.3 93.04,66.46 v91.3,68.2
(copper drawn outside any net)
  shapes: Bottom area x2

### Text on the board
Bottom: Pedal Board V1